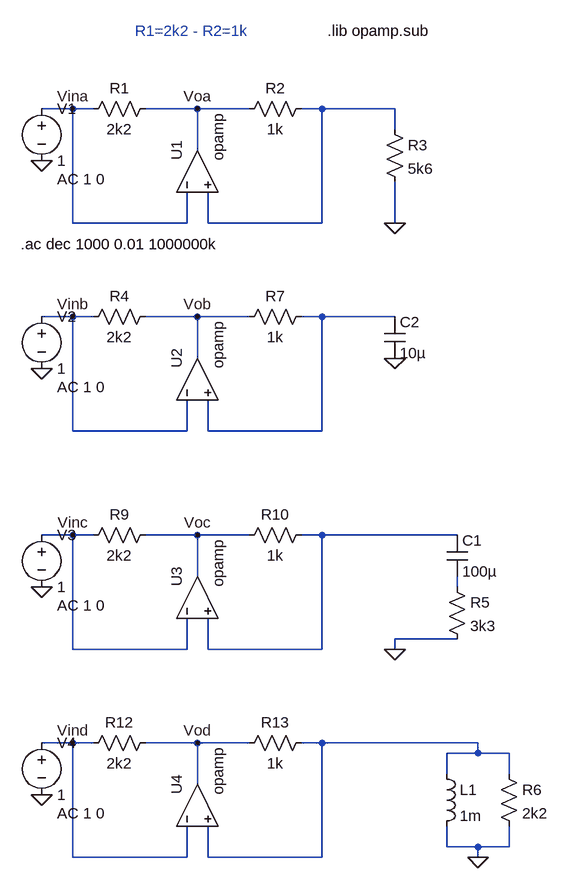
[diagram p0: schematic EJ9.asc]
EJ9.asc, the LTspice schematic file:
Version 4
SHEET 1 1076 1204
WIRE 32 32 -16 32
WIRE 64 32 32 32
WIRE 224 32 144 32
WIRE 304 32 224 32
WIRE 416 32 384 32
WIRE 528 32 416 32
WIRE 528 64 528 32
WIRE 224 96 224 32
WIRE 32 208 32 32
WIRE 208 208 208 160
WIRE 208 208 32 208
WIRE 240 208 240 160
WIRE 416 208 416 32
WIRE 416 208 240 208
WIRE 528 208 528 144
WIRE 32 352 -16 352
WIRE 64 352 32 352
WIRE 224 352 144 352
WIRE 304 352 224 352
WIRE 416 352 384 352
WIRE 528 352 416 352
WIRE 224 416 224 352
WIRE 32 528 32 352
WIRE 208 528 208 480
WIRE 208 528 32 528
WIRE 240 528 240 480
WIRE 416 528 416 352
WIRE 416 528 240 528
WIRE 32 688 -16 688
WIRE 64 688 32 688
WIRE 224 688 144 688
WIRE 304 688 224 688
WIRE 416 688 384 688
WIRE 624 688 416 688
WIRE 224 752 224 688
WIRE 624 768 624 752
WIRE 624 848 528 848
WIRE 32 864 32 688
WIRE 208 864 208 816
WIRE 208 864 32 864
WIRE 240 864 240 816
WIRE 416 864 416 688
WIRE 416 864 240 864
WIRE 528 864 528 848
WIRE 32 1008 -16 1008
WIRE 64 1008 32 1008
WIRE 224 1008 144 1008
WIRE 304 1008 224 1008
WIRE 416 1008 384 1008
WIRE 656 1008 416 1008
WIRE 656 1024 656 1008
WIRE 656 1024 608 1024
WIRE 704 1024 656 1024
WIRE 608 1056 608 1024
WIRE 704 1056 704 1024
WIRE 224 1072 224 1008
WIRE 608 1168 608 1136
WIRE 656 1168 608 1168
WIRE 704 1168 704 1136
WIRE 704 1168 656 1168
WIRE 32 1184 32 1008
WIRE 208 1184 208 1136
WIRE 208 1184 32 1184
WIRE 240 1184 240 1136
WIRE 416 1184 416 1008
WIRE 416 1184 240 1184
WIRE 656 1184 656 1168
FLAG -16 112 0
FLAG 528 208 0
FLAG 224 32 Voa
FLAG 32 32 Vina
FLAG -16 432 0
FLAG 224 352 Vob
FLAG 32 352 Vinb
FLAG -16 768 0
FLAG 528 864 0
FLAG 224 688 Voc
FLAG 32 688 Vinc
FLAG -16 1088 0
FLAG 224 1008 Vod
FLAG 32 1008 Vind
FLAG 656 1184 0
FLAG 528 416 0
SYMBOL OpAmps\\opamp 160 128 R270
SYMATTR InstName U1
SYMBOL res 160 16 R90
WINDOW 0 0 56 VBottom 2
WINDOW 3 32 56 VTop 2
SYMATTR InstName R1
SYMATTR Value 2k2
SYMBOL res 400 16 R90
WINDOW 0 0 56 VBottom 2
WINDOW 3 32 56 VTop 2
SYMATTR InstName R2
SYMATTR Value 1k
SYMBOL voltage -16 16 R0
WINDOW 123 24 124 Left 2
WINDOW 39 0 0 Left 0
SYMATTR InstName V1
SYMATTR Value 1
SYMATTR Value2 AC 1 0
SYMBOL res 512 48 R0
SYMATTR InstName R3
SYMATTR Value 5k6
SYMBOL cap 608 688 R0
SYMATTR InstName C1
SYMATTR Value 100µ
SYMBOL ind 592 1040 R0
SYMATTR InstName L1
SYMATTR Value 1m
SYMBOL res 608 752 R0
SYMATTR InstName R5
SYMATTR Value 3k3
SYMBOL res 688 1040 R0
SYMATTR InstName R6
SYMATTR Value 2k2
SYMBOL OpAmps\\opamp 160 448 R270
SYMATTR InstName U2
SYMBOL res 160 336 R90
WINDOW 0 0 56 VBottom 2
WINDOW 3 32 56 VTop 2
SYMATTR InstName R4
SYMATTR Value 2k2
SYMBOL res 400 336 R90
WINDOW 0 0 56 VBottom 2
WINDOW 3 32 56 VTop 2
SYMATTR InstName R7
SYMATTR Value 1k
SYMBOL voltage -16 336 R0
WINDOW 123 24 124 Left 2
WINDOW 39 0 0 Left 0
SYMATTR InstName V2
SYMATTR Value 1
SYMATTR Value2 AC 1 0
SYMBOL OpAmps\\opamp 160 784 R270
SYMATTR InstName U3
SYMBOL res 160 672 R90
WINDOW 0 0 56 VBottom 2
WINDOW 3 32 56 VTop 2
SYMATTR InstName R9
SYMATTR Value 2k2
SYMBOL res 400 672 R90
WINDOW 0 0 56 VBottom 2
WINDOW 3 32 56 VTop 2
SYMATTR InstName R10
SYMATTR Value 1k
SYMBOL voltage -16 672 R0
WINDOW 123 24 124 Left 2
WINDOW 39 0 0 Left 0
SYMATTR InstName V3
SYMATTR Value 1
SYMATTR Value2 AC 1 0
SYMBOL OpAmps\\opamp 160 1104 R270
SYMATTR InstName U4
SYMBOL res 160 992 R90
WINDOW 0 0 56 VBottom 2
WINDOW 3 32 56 VTop 2
SYMATTR InstName R12
SYMATTR Value 2k2
SYMBOL res 400 992 R90
WINDOW 0 0 56 VBottom 2
WINDOW 3 32 56 VTop 2
SYMATTR InstName R13
SYMATTR Value 1k
SYMBOL voltage -16 992 R0
WINDOW 123 24 124 Left 2
WINDOW 39 0 0 Left 0
SYMATTR InstName V4
SYMATTR Value 1
SYMATTR Value2 AC 1 0
SYMBOL cap 512 352 R0
SYMATTR InstName C2
SYMATTR Value 10µ
TEXT 424 -88 Left 2 !.lib opamp.sub
TEXT 128 -88 Left 2 ;R1=2k2 - R2=1k
TEXT -48 240 Left 2 !.ac dec 1000 0.01 1000000k

The netlist it stands for:
* EJ9.asc
XU1 Vina N001 Voa opamp Aol=100K GBW=10Meg  ; pins invin noninvin out
R1 Voa Vina 2k2
R2 N001 Voa 1k
V1 Vina 0 1 AC 1 0
R3 N001 0 5k6
C1 N003 N004 100µ
L1 N005 0 1m
R5 N004 0 3k3
R6 N005 0 2k2
XU2 Vinb N002 Vob opamp Aol=100K GBW=10Meg  ; pins invin noninvin out
R4 Vob Vinb 2k2
R7 N002 Vob 1k
V2 Vinb 0 1 AC 1 0
XU3 Vinc N003 Voc opamp Aol=100K GBW=10Meg  ; pins invin noninvin out
R9 Voc Vinc 2k2
R10 N003 Voc 1k
V3 Vinc 0 1 AC 1 0
XU4 Vind N005 Vod opamp Aol=100K GBW=10Meg  ; pins invin noninvin out
R12 Vod Vind 2k2
R13 N005 Vod 1k
V4 Vind 0 1 AC 1 0
C2 N002 0 10µ
.lib opamp.sub
* R1=2k2 - R2=1k
.ac dec 1000 0.01 1000000k
.backanno
.end